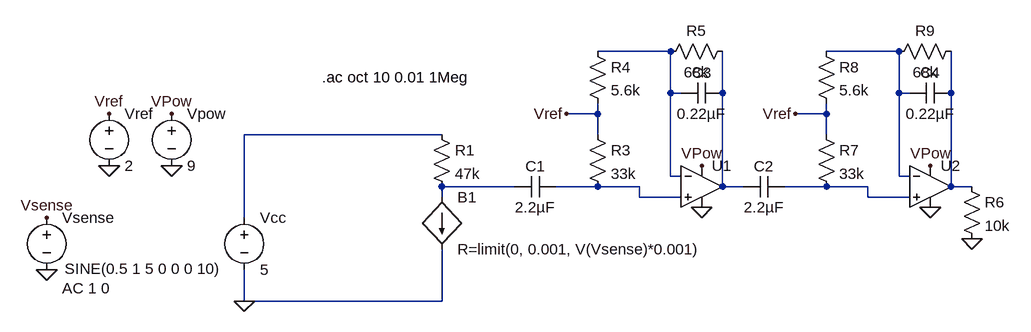
[diagram p0: schematic PTSensor.asc]
PTSensor.asc, the LTspice schematic file:
Version 4
SHEET 1 880 680
WIRE 192 -48 80 -48
WIRE 544 -48 432 -48
WIRE 192 16 192 -48
WIRE 208 16 192 16
WIRE 272 16 272 -48
WIRE 544 16 544 -48
WIRE 560 16 544 16
WIRE 624 16 624 -48
WIRE 80 48 80 32
WIRE 80 48 32 48
WIRE 432 48 432 32
WIRE 432 48 384 48
WIRE -160 80 -464 80
WIRE 80 80 80 48
WIRE 432 80 432 48
WIRE 192 144 192 16
WIRE 208 144 192 144
WIRE 544 144 544 16
WIRE 560 144 544 144
WIRE -48 160 -160 160
WIRE 80 160 16 160
WIRE 144 160 80 160
WIRE 272 160 272 16
WIRE 304 160 272 160
WIRE 432 160 368 160
WIRE 496 160 432 160
WIRE 624 160 624 16
WIRE 656 160 624 160
WIRE -160 176 -160 160
WIRE 144 176 144 160
WIRE 208 176 144 176
WIRE 496 176 496 160
WIRE 560 176 496 176
WIRE -464 208 -464 80
WIRE -464 336 -464 288
WIRE -160 336 -160 256
WIRE -160 336 -464 336
FLAG -768 288 0
FLAG -672 128 0
FLAG -576 128 0
FLAG 240 192 0
FLAG -672 48 Vref
FLAG -576 48 VPow
FLAG 240 128 VPow
FLAG -464 336 0
FLAG -768 208 Vsense
FLAG 32 48 Vref
FLAG 656 240 0
FLAG 592 192 0
FLAG 592 128 VPow
FLAG 384 48 Vref
SYMBOL Opamps\\UniversalOpamp2 240 160 R0
SYMATTR InstName U1
SYMBOL voltage -576 32 R0
WINDOW 123 0 0 Left 2
WINDOW 39 0 0 Left 2
SYMATTR InstName Vpow
SYMATTR Value 9
SYMBOL voltage -768 192 R0
WINDOW 3 148 110 Bottom 2
WINDOW 123 24 124 Left 2
WINDOW 39 0 0 Left 2
SYMATTR Value SINE(0.5 1 5 0 0 0 10)
SYMATTR Value2 AC 1 0
SYMATTR InstName Vsense
SYMBOL voltage -672 32 R0
WINDOW 123 0 0 Left 2
WINDOW 39 0 0 Left 2
SYMATTR InstName Vref
SYMATTR Value 2
SYMBOL res -176 64 R0
SYMATTR InstName R1
SYMATTR Value 47k
SYMBOL voltage -464 192 R0
WINDOW 123 0 0 Left 2
WINDOW 39 0 0 Left 2
SYMATTR InstName Vcc
SYMATTR Value 5
SYMBOL cap -48 176 R270
WINDOW 0 32 32 VTop 2
WINDOW 3 0 32 VBottom 2
SYMATTR InstName C1
SYMATTR Value 2.2µF
SYMBOL cap 208 32 R270
WINDOW 0 32 32 VTop 2
WINDOW 3 0 32 VBottom 2
SYMATTR InstName C3
SYMATTR Value 0.22µF
SYMBOL res 64 64 R0
SYMATTR InstName R3
SYMATTR Value 33k
SYMBOL res 64 -64 R0
SYMATTR InstName R4
SYMATTR Value 5.6k
SYMBOL res 176 -32 R270
WINDOW 0 32 56 VTop 2
WINDOW 3 0 56 VBottom 2
SYMATTR InstName R5
SYMATTR Value 68k
SYMBOL res 640 144 R0
SYMATTR InstName R6
SYMATTR Value 10k
SYMBOL Opamps\\UniversalOpamp2 592 160 R0
SYMATTR InstName U2
SYMBOL cap 304 176 R270
WINDOW 0 32 32 VTop 2
WINDOW 3 0 32 VBottom 2
SYMATTR InstName C2
SYMATTR Value 2.2µF
SYMBOL cap 560 32 R270
WINDOW 0 32 32 VTop 2
WINDOW 3 0 32 VBottom 2
SYMATTR InstName C4
SYMATTR Value 0.22µF
SYMBOL res 416 64 R0
SYMATTR InstName R7
SYMATTR Value 33k
SYMBOL res 416 -64 R0
SYMATTR InstName R8
SYMATTR Value 5.6k
SYMBOL res 528 -32 R270
WINDOW 0 32 56 VTop 2
WINDOW 3 0 56 VBottom 2
SYMATTR InstName R9
SYMATTR Value 68k
SYMBOL bi -160 176 R0
SYMATTR InstName B1
SYMATTR Value R=limit(0, 0.001, V(Vsense)*0.001)
TEXT -344 -8 Left 2 !.ac oct 10 0.01 1Meg

The netlist it stands for:
* PTSensor.asc
XU1 N007 N001 VPow 0 N003 level.2 Avol=1Meg GBW=10Meg Slew=10Meg ilimit=25m rail=0 Vos=0 phimargin=45 en=0 enk=0 in=0 ink=0 Rin=500Meg  ; pins IN+ IN- V+ V- OUT
Vpow VPow 0 9
Vsense Vsense 0 SINE(0.5 1 5 0 0 0 10) AC 1 0
Vref Vref 0 2
R1 N005 N006 47k
Vcc N005 0 5
C1 N006 N007 2.2µF
C3 N001 N003 0.22µF
R3 Vref N007 33k
R4 N001 Vref 5.6k
R5 N001 N003 68k
R6 N004 0 10k
XU2 N008 N002 VPow 0 N004 level.2 Avol=1Meg GBW=10Meg Slew=10Meg ilimit=25m rail=0 Vos=0 phimargin=45 en=0 enk=0 in=0 ink=0 Rin=500Meg  ; pins IN+ IN- V+ V- OUT
C2 N003 N008 2.2µF
C4 N002 N004 0.22µF
R7 Vref N008 33k
R8 N002 Vref 5.6k
R9 N002 N004 68k
B1 N006 0 R=limit(0, 0.001, V(Vsense)*0.001)
.ac oct 10 0.01 1Meg
.lib UniversalOpamps2.sub
.backanno
.end